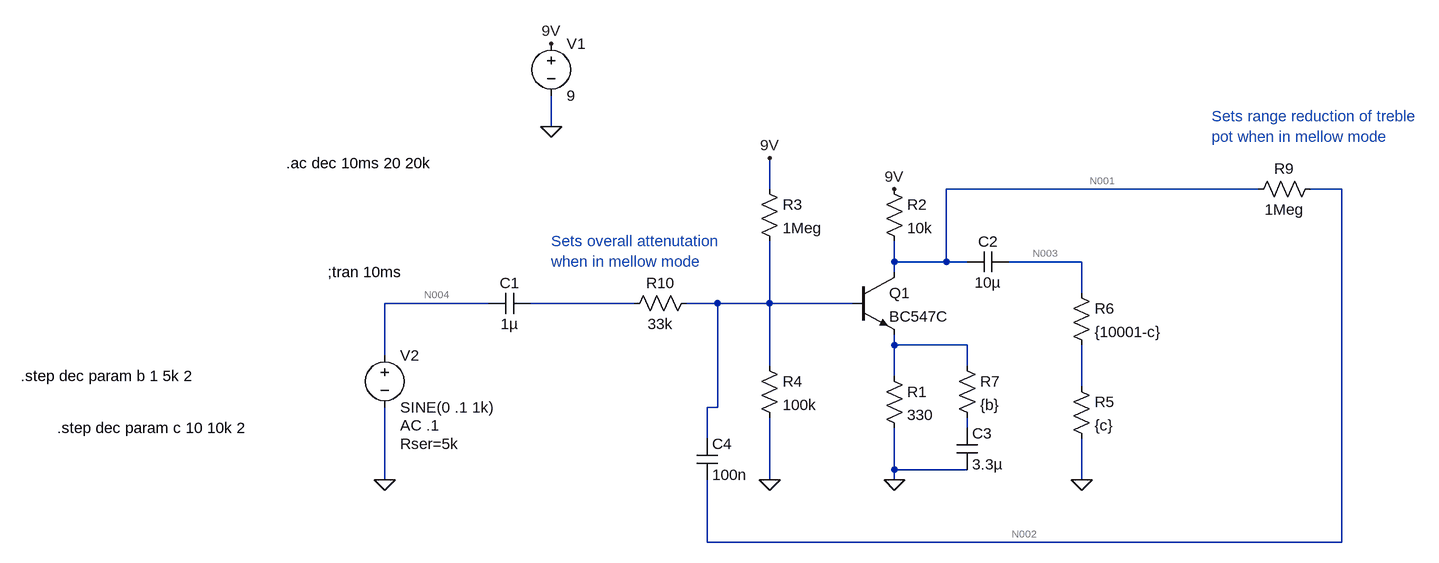
[diagram p0: schematic TrebleBoost.asc]
TrebleBoost.asc, the LTspice schematic file:
Version 4
SHEET 1 1036 680
WIRE -320 -96 -320 -144
WIRE 16 0 16 -48
WIRE 768 0 288 0
WIRE 896 0 848 0
WIRE 208 112 208 80
WIRE 288 112 288 0
WIRE 288 112 208 112
WIRE 320 112 288 112
WIRE 496 112 384 112
WIRE 208 128 208 112
WIRE 496 160 496 112
WIRE -416 176 -576 176
WIRE -192 176 -352 176
WIRE -64 176 -112 176
WIRE 16 176 16 80
WIRE 16 176 -64 176
WIRE 144 176 16 176
WIRE 208 240 208 224
WIRE 320 240 208 240
WIRE -576 256 -576 176
WIRE 16 272 16 176
WIRE 320 272 320 240
WIRE 208 288 208 240
WIRE 496 304 496 240
WIRE -64 336 -64 176
WIRE -64 336 -80 336
WIRE 320 368 320 352
WIRE -80 384 -80 336
WIRE 208 432 208 368
WIRE 320 432 208 432
WIRE -576 448 -576 336
WIRE 16 448 16 352
WIRE 208 448 208 432
WIRE 496 448 496 384
WIRE -80 544 -80 448
WIRE 896 544 896 0
WIRE 896 544 -80 544
FLAG -320 -96 0
FLAG -576 448 0
FLAG 16 448 0
FLAG 208 448 0
FLAG 496 448 0
FLAG -320 -224 9V
FLAG 208 0 9V
FLAG 16 -48 9V
DATAFLAG 208 240 ""
DATAFLAG 208 112 ""
SYMBOL npn 144 128 R0
SYMATTR InstName Q1
SYMATTR Value BC547C
SYMBOL res 192 272 R0
SYMATTR InstName R1
SYMATTR Value 330
SYMBOL res 192 -16 R0
SYMATTR InstName R2
SYMATTR Value 10k
SYMBOL res 0 -16 R0
SYMATTR InstName R3
SYMATTR Value 1Meg
SYMBOL res 0 256 R0
SYMATTR InstName R4
SYMATTR Value 100k
SYMBOL res 480 288 R0
SYMATTR InstName R5
SYMATTR Value {c}
SYMBOL res 480 144 R0
SYMATTR InstName R6
SYMATTR Value {10001-c}
SYMBOL cap -352 160 R90
WINDOW 0 0 32 VBottom 2
WINDOW 3 32 32 VTop 2
SYMATTR InstName C1
SYMATTR Value 1µ
SYMBOL cap 384 96 R90
WINDOW 0 0 32 VBottom 2
WINDOW 3 32 32 VTop 2
SYMATTR InstName C2
SYMATTR Value 10µ
SYMBOL voltage -320 -240 R0
WINDOW 123 0 0 Left 2
WINDOW 39 0 0 Left 2
SYMATTR InstName V1
SYMATTR Value 9
SYMBOL voltage -576 240 R0
WINDOW 123 24 124 Left 2
WINDOW 39 24 152 Left 2
SYMATTR Value2 AC .1
SYMATTR SpiceLine Rser=5k
SYMATTR InstName V2
SYMATTR Value SINE(0 .1 1k)
SYMBOL cap 304 368 R0
SYMATTR InstName C3
SYMATTR Value 3.3µ
SYMBOL res 304 256 R0
SYMATTR InstName R7
SYMATTR Value {b}
SYMBOL res 864 -16 R90
WINDOW 0 0 56 VBottom 2
WINDOW 3 32 56 VTop 2
SYMATTR InstName R9
SYMATTR Value 1Meg
SYMBOL cap -96 384 R0
SYMATTR InstName C4
SYMATTR Value 100n
SYMBOL res -96 160 R90
WINDOW 0 0 56 VBottom 2
WINDOW 3 32 56 VTop 2
SYMATTR InstName R10
SYMATTR Value 33k
TEXT -728 -40 Left 2 !.ac dec 10ms 20 20k
TEXT -664 128 Left 2 !;tran 10ms
TEXT -1136 288 Left 2 !.step dec param b 1 5k 2
TEXT -1080 368 Left 2 !.step dec param c 10 10k 2
TEXT -320 80 Left 2 ;Sets overall attenutation \nwhen in mellow mode
TEXT 696 -112 Left 2 ;Sets range reduction of treble\npot when in mellow mode

The netlist it stands for:
* TrebleBoost.asc
Q1 N001 N006 N007 0 BC547C
R1 N007 0 330
R2 9V N001 10k
R3 9V N006 1Meg
R4 N006 0 100k
R5 N008 0 {c}
R6 N003 N008 {10001-c}
C1 N005 N004 1µ
C2 N003 N001 10µ
V1 9V 0 9
V2 N004 0 SINE(0 .1 1k) AC .1 Rser=5k
C3 N009 0 3.3µ
R7 N007 N009 {b}
R9 N002 N001 1Meg
C4 N006 N002 100n
R10 N006 N005 33k
.model NPN NPN
.model PNP PNP
.lib standard.bjt
.ac dec 10ms 20 20k
;tran 10ms
.step dec param b 1 5k 2
.step dec param c 10 10k 2
* Sets overall attenutation
* when in mellow mode
* Sets range reduction of treble
* pot when in mellow mode
.backanno
.end

* Results of the author's LTspice run, read from the files saved beside the schematic
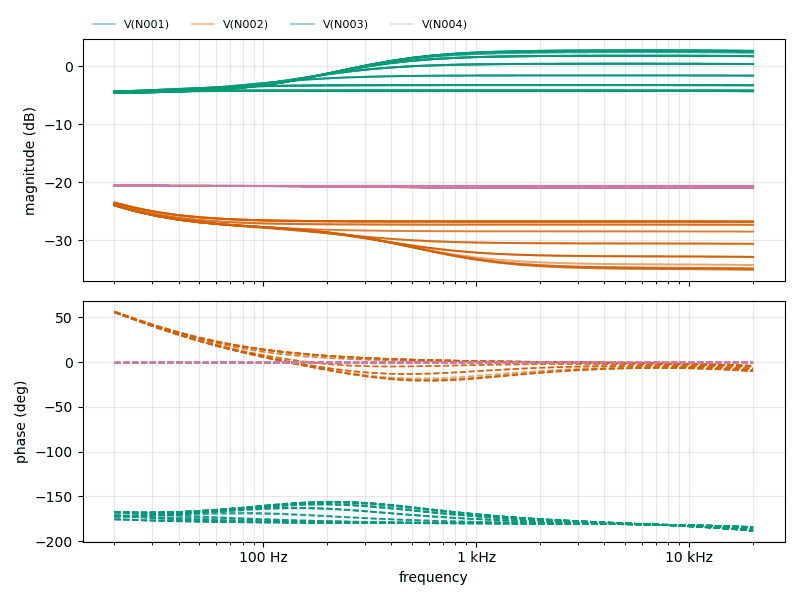
[diagram p1: AC Analysis of TrebleBoost.asc, plotted from the saved traces]
* AC Analysis, 63 runs:
*   V(N001) [run 1]: -4.60 dB at 20 Hz, 2.61 dB at 20 kHz, peak 2.69 dB at 6.325 kHz, 3 dB below the peak at 268.4 Hz
*   V(N001) [run 2]: -4.57 dB at 20 Hz, 0.34 dB at 20 kHz, peak 0.39 dB at 5.024 kHz, 3 dB below the peak at 121.5 Hz
*   V(N001) [run 3]: -4.39 dB at 20 Hz, -4.31 dB at 20 kHz, peak -4.29 dB at 1.002 kHz
*   V(N001) [run 4]: -4.59 dB at 20 Hz, 1.70 dB at 20 kHz, peak 1.78 dB at 6.325 kHz, 3 dB below the peak at 205 Hz
*   V(N001) [run 5]: -4.33 dB at 20 Hz, -4.15 dB at 20 kHz, peak -4.12 dB at 1.262 kHz
*   V(N001) [run 6]: -4.60 dB at 20 Hz, 2.31 dB at 20 kHz, peak 2.40 dB at 6.325 kHz, 3 dB below the peak at 246.8 Hz
*   V(N001) [run 7]: -4.39 dB at 20 Hz, -3.31 dB at 20 kHz, peak -3.28 dB at 2.518 kHz
*   V(N001) [run 8]: -4.60 dB at 20 Hz, 2.53 dB at 20 kHz, peak 2.62 dB at 6.325 kHz, 3 dB below the peak at 263 Hz
*   V(N002) [run 1]: -24.00 dB at 20 Hz, -35.07 dB at 20 kHz, peak -24.00 dB at 20 Hz, 3 dB below the peak at 54.07 Hz
*   V(N002) [run 2]: -23.98 dB at 20 Hz, -30.62 dB at 20 kHz, peak -23.98 dB at 20 Hz, 3 dB below the peak at 53.01 Hz
*   V(N002) [run 3]: -23.51 dB at 20 Hz, -26.78 dB at 20 kHz, peak -23.51 dB at 20 Hz, 3 dB below the peak at 91.55 Hz
*   V(N002) [run 4]: -23.99 dB at 20 Hz, -32.87 dB at 20 kHz, peak -23.99 dB at 20 Hz, 3 dB below the peak at 53.62 Hz
*   V(N002) [run 5]: -23.58 dB at 20 Hz, -26.87 dB at 20 kHz, peak -23.58 dB at 20 Hz, 3 dB below the peak at 88.44 Hz
*   V(N002) [run 6]: -24.00 dB at 20 Hz, -34.27 dB at 20 kHz, peak -24.00 dB at 20 Hz, 3 dB below the peak at 53.93 Hz
*   V(N002) [run 7]: -23.84 dB at 20 Hz, -27.34 dB at 20 kHz, peak -23.84 dB at 20 Hz, 3 dB below the peak at 66.89 Hz
*   V(N002) [run 8]: -24.00 dB at 20 Hz, -34.86 dB at 20 kHz, peak -24.00 dB at 20 Hz, 3 dB below the peak at 54.04 Hz
*   V(N003) [run 1]: -4.63 dB at 20 Hz, 2.61 dB at 20 kHz, peak 2.69 dB at 6.325 kHz, 3 dB below the peak at 268.4 Hz
*   V(N003) [run 2]: -4.60 dB at 20 Hz, 0.34 dB at 20 kHz, peak 0.39 dB at 5.024 kHz, 3 dB below the peak at 121.6 Hz
*   V(N003) [run 3]: -4.42 dB at 20 Hz, -4.31 dB at 20 kHz, peak -4.29 dB at 1.002 kHz
*   V(N003) [run 4]: -4.62 dB at 20 Hz, 1.70 dB at 20 kHz, peak 1.78 dB at 6.325 kHz, 3 dB below the peak at 205 Hz
*   V(N003) [run 5]: -4.36 dB at 20 Hz, -4.15 dB at 20 kHz, peak -4.12 dB at 1.262 kHz
*   V(N003) [run 6]: -4.63 dB at 20 Hz, 2.31 dB at 20 kHz, peak 2.40 dB at 6.325 kHz, 3 dB below the peak at 246.9 Hz
*   V(N003) [run 7]: -4.42 dB at 20 Hz, -3.31 dB at 20 kHz, peak -3.28 dB at 2.518 kHz
*   V(N003) [run 8]: -4.63 dB at 20 Hz, 2.53 dB at 20 kHz, peak 2.62 dB at 6.325 kHz, 3 dB below the peak at 263 Hz
*   V(N004) [run 1]: -20.62 dB at 20 Hz, -21.00 dB at 20 kHz, peak -20.62 dB at 20 Hz
*   V(N004) [run 2]: -20.62 dB at 20 Hz, -20.85 dB at 20 kHz, peak -20.62 dB at 20 Hz
*   V(N004) [run 3]: -20.63 dB at 20 Hz, -20.64 dB at 20 kHz, peak -20.63 dB at 20 Hz
*   V(N004) [run 4]: -20.62 dB at 20 Hz, -20.93 dB at 20 kHz, peak -20.62 dB at 20 Hz
*   V(N004) [run 5]: -20.63 dB at 20 Hz, -20.65 dB at 20 kHz, peak -20.63 dB at 20 Hz
*   V(N004) [run 6]: -20.62 dB at 20 Hz, -20.98 dB at 20 kHz, peak -20.62 dB at 20 Hz
*   V(N004) [run 7]: -20.63 dB at 20 Hz, -20.68 dB at 20 kHz, peak -20.63 dB at 20 Hz
*   V(N004) [run 8]: -20.62 dB at 20 Hz, -20.99 dB at 20 kHz, peak -20.62 dB at 20 Hz